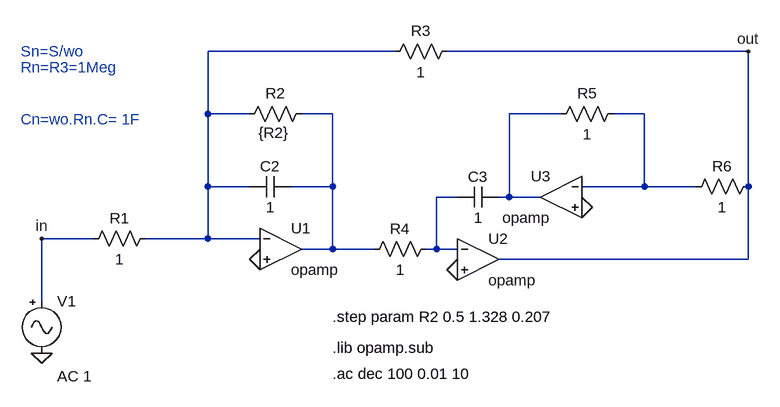
[diagram p0: schematic TS2_normalizado.asc]
TS2_normalizado.asc, the LTspice schematic file:
Version 4
SHEET 1 880 680
WIRE 224 -160 -64 -160
WIRE 768 -160 304 -160
WIRE -64 -64 -64 -160
WIRE 0 -64 -64 -64
WIRE 128 -64 80 -64
WIRE 480 -64 400 -64
WIRE 608 -64 560 -64
WIRE -64 48 -64 -64
WIRE 0 48 -64 48
WIRE 128 48 128 -64
WIRE 128 48 64 48
WIRE 608 48 608 -64
WIRE 608 48 512 48
WIRE 688 48 608 48
WIRE 768 48 768 -160
WIRE 320 64 288 64
WIRE 400 64 400 -64
WIRE 400 64 384 64
WIRE 448 64 400 64
WIRE -240 128 -320 128
WIRE -64 128 -64 48
WIRE -64 128 -160 128
WIRE 16 128 -64 128
WIRE 128 144 128 48
WIRE 128 144 80 144
WIRE 192 144 128 144
WIRE 288 144 288 64
WIRE 288 144 272 144
WIRE 320 144 288 144
WIRE 768 160 768 48
WIRE 768 160 384 160
WIRE -320 224 -320 128
FLAG 320 176 0
FLAG 16 160 0
FLAG 512 80 0
FLAG -320 304 0
FLAG -320 128 in
FLAG 768 -160 out
SYMBOL OpAmps\\opamp 48 80 R0
SYMATTR InstName U1
SYMBOL OpAmps\\opamp 352 96 R0
SYMATTR InstName U2
SYMBOL OpAmps\\opamp 480 0 M0
SYMATTR InstName U3
SYMBOL res 576 -80 R90
WINDOW 0 0 56 VBottom 2
WINDOW 3 32 56 VTop 2
SYMATTR InstName R5
SYMATTR Value 1
SYMBOL res 784 32 R90
WINDOW 0 0 56 VBottom 2
WINDOW 3 32 56 VTop 2
SYMATTR InstName R6
SYMATTR Value 1
SYMBOL res 288 128 R90
WINDOW 0 0 56 VBottom 2
WINDOW 3 32 56 VTop 2
SYMATTR InstName R4
SYMATTR Value 1
SYMBOL cap 64 32 R90
WINDOW 0 0 32 VBottom 2
WINDOW 3 32 32 VTop 2
SYMATTR InstName C2
SYMATTR Value 1
SYMBOL cap 384 48 R90
WINDOW 0 0 32 VBottom 2
WINDOW 3 32 32 VTop 2
SYMATTR InstName C3
SYMATTR Value 1
SYMBOL res -144 112 R90
WINDOW 0 0 56 VBottom 2
WINDOW 3 32 56 VTop 2
SYMATTR InstName R1
SYMATTR Value 1
SYMBOL res 96 -80 R90
WINDOW 0 0 56 VBottom 2
WINDOW 3 61 58 VBottom 2
SYMATTR InstName R2
SYMATTR Value {R2}
SYMBOL Misc\\signal -320 208 R0
WINDOW 123 24 132 Left 2
WINDOW 39 0 0 Left 0
SYMATTR Value2 AC 1
SYMATTR InstName V1
SYMATTR Value ""
SYMBOL res 320 -176 R90
WINDOW 0 0 56 VBottom 2
WINDOW 3 32 56 VTop 2
SYMATTR InstName R3
SYMATTR Value 1
TEXT 128 336 Left 2 !.ac dec 100 0.01 10
TEXT 128 296 Left 2 !.lib opamp.sub
TEXT -352 -56 Left 2 ;Cn=wo.Rn.C= 1F
TEXT -352 -160 Left 2 ;Sn=S/wo
TEXT -352 -136 Left 2 ;Rn=R3=1Meg
TEXT 128 248 Left 2 !.step param R2 0.5 1.328 0.207

The netlist it stands for:
* TS2_normalizado.asc
XU1 N001 0 N002 opamp Aol=100K GBW=10Meg  ; pins invin noninvin out
XU2 N005 0 out opamp Aol=100K GBW=10Meg  ; pins invin noninvin out
XU3 N004 0 N003 opamp Aol=100K GBW=10Meg  ; pins invin noninvin out
R5 N004 N003 1
R6 out N004 1
R4 N005 N002 1
C2 N002 N001 1
C3 N003 N005 1
R1 N001 in 1
R2 N002 N001 {R2}
V1 in 0 AC 1
R3 out N001 1
.ac dec 100 0.01 10
.lib opamp.sub
* Cn=wo.Rn.C= 1F
* Sn=S/wo
* Rn=R3=1Meg
.step param R2 0.5 1.328 0.207
.backanno
.end

* Results of the author's LTspice run, read from the files saved beside the schematic
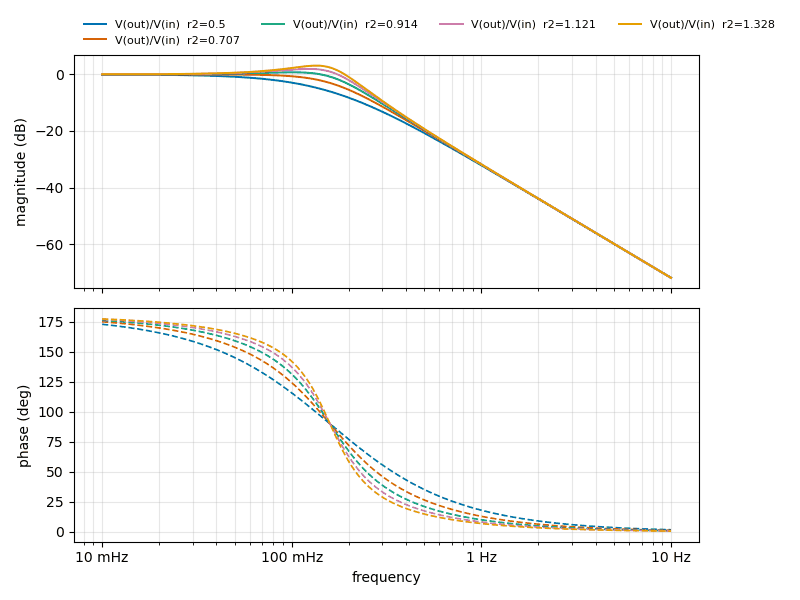
[diagram p1: AC Analysis of TS2_normalizado.asc, plotted from the saved traces]
* AC Analysis, 5 runs:
*   V(out)/V(in) [r2=0.5]: -0.03 dB at 10 mHz, -71.93 dB at 10 Hz, peak -0.03 dB at 10 mHz, 3 dB below the peak at 103.1 mHz
*   V(out)/V(in) [r2=0.707]: 0.00 dB at 10 mHz, -71.93 dB at 10 Hz, peak 0.00 dB at 10 mHz, 3 dB below the peak at 159.1 mHz
*   V(out)/V(in) [r2=0.914]: 0.01 dB at 10 mHz, -71.93 dB at 10 Hz, peak 0.76 dB at 100 mHz, 3 dB below the peak at 182.7 mHz
*   V(out)/V(in) [r2=1.121]: 0.02 dB at 10 mHz, -71.93 dB at 10 Hz, peak 1.96 dB at 123 mHz, 3 dB below the peak at 188.3 mHz
*   V(out)/V(in) [r2=1.328]: 0.02 dB at 10 mHz, -71.93 dB at 10 Hz, peak 3.13 dB at 134.9 mHz, 3 dB below the peak at 21.85 mHz and 189.2 mHz